# Altium schematic sheet misc.SchDoc
size A4
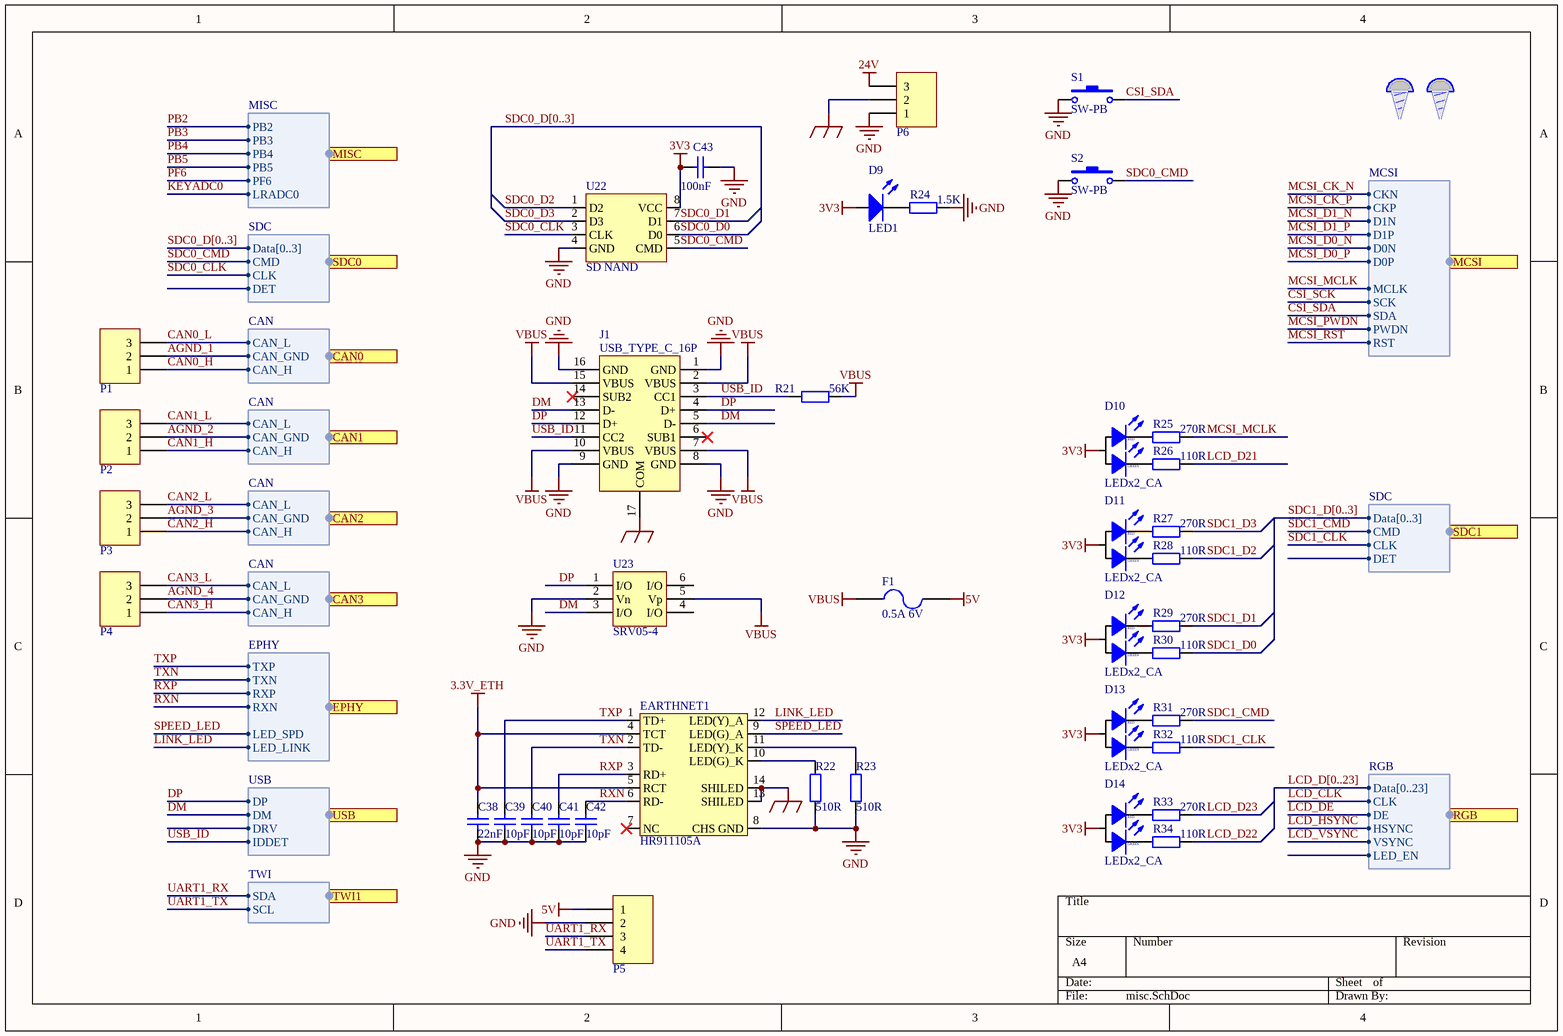
[diagram p0: misc.SchDoc]

## Parts
C38  22nF  [CAPC1608L]
C39  10pF  [CAPC1608L]
C40  10pF  [CAPC1608L]
C41  10pF  [CAPC1608L]
C42  10pF  [CAPC1608L]
C43  100nF  [CAPC1608L]
D9  LED1  [LED_3]
D10  LEDx2_CA  [LED_3x2]
D11  LEDx2_CA  [LED_3x2]
D12  LEDx2_CA  [LED_3x2]
D13  LEDx2_CA  [LED_3x2]
D14  LEDx2_CA  [LED_3x2]
EARTHNET1  HR911105A  [HR911105A]
F1  0.5A 6V  [FUSE2012L]
J1  USB_TYPE_C_16P  [USB_TYPEC_16P]
M1  M  [M3]  (value not drawn)
M2  M  [M3]  (value not drawn)
P1  Header 3  [KF2EDGR-5.08-3P_S]  (value not drawn)
P2  Header 3  [KF2EDGR-5.08-3P_S]  (value not drawn)
P3  Header 3  [KF2EDGR-5.08-3P_S]  (value not drawn)
P4  Header 3  [KF2EDGR-5.08-3P_S]  (value not drawn)
P5  Header 4  [HDR1X4]  (value not drawn)
P6  Header 3  [KF2EDGR-5.08-3P_S]  (value not drawn)
R21  56K  [RESC1005L]
R22  510R  [RESC1608L]
R23  510R  [RESC1608L]
R24  1.5K  [RESC1608L]
R25  270R  [RESC1608L]
R26  110R  [RESC1608L]
R27  270R  [RESC1608L]
R28  110R  [RESC1608L]
R29  270R  [RESC1608L]
R30  110R  [RESC1608L]
R31  270R  [RESC1608L]
R32  110R  [RESC1608L]
R33  270R  [RESC1608L]
R34  110R  [RESC1608L]
S1  SW-PB  [SW_4.5x3.8]
S2  SW-PB  [SW-3x6]
U22  SD NAND  [QFN8_L]
U23  SRV05-4  [SOT23-6_L]

## Ports
CAN0 (harness CAN), CAN1 (harness CAN), CAN2 (harness CAN), CAN3 (harness CAN), EPHY (harness EPHY), MCSI (harness MCSI), MISC (harness MISC), RGB (harness RGB), SDC0 (harness SDC), SDC1 (harness SDC), TWI1 (harness TWI), USB (harness USB)

## Harnesses
SDC: Data[0..3], CMD, CLK, DET
CAN: CAN_L, CAN_GND, CAN_H
EPHY: TXP, TXN, RXP, RXN, LED_SPD, LED_LINK
USB: DP, DM, DRV, IDDET
MISC: PB2, PB3, PB4, PB5, LRADC0, PF6
MCSI: CKN, CKP, D1N, D1P, D0N, D0P, MCLK, SCK, SDA, PWDN, RST
RGB: Data[0..23], CLK, DE, HSYNC, VSYNC, LED_EN
TWI: SDA, SCL

## Nets
3.3V_ETH: C38.2 EARTHNET1.4(TCT) EARTHNET1.5(RCT)
3V3: C43.1 D9.1(A) D10.2(A) D11.2(A) D12.2(A) D13.2(A) D14.2(A) U22.8(VCC)
5V: F1.2 P5.1
24V: P6.3
EARTH: EARTHNET1.13(SHILED) EARTHNET1.14(SHILED) J1.17(COM) P6.2
GND: C38.1 C39.1 C40.1 C41.1 C42.1 C43.2 EARTHNET1.8(CHS_GND) J1.1(GND) J1.8(GND) J1.9(GND) J1.16(GND) P5.2 P6.1 R22.1 R23.1 R24.2 S1.1 S2.1 U22.4(GND) U23.2(Vn)
VBUS: F1.1 J1.2(VBUS) J1.7(VBUS) J1.10(VBUS) J1.15(VBUS) R21.2 U23.5(Vp)
AGND_1: P1.2 ; port CAN0.CAN_GND
AGND_2: P2.2 ; port CAN1.CAN_GND
AGND_3: P3.2 ; port CAN2.CAN_GND
AGND_4: P4.2 ; port CAN3.CAN_GND
CAN0_H: P1.1 ; port CAN0.CAN_H
CAN0_L: P1.3 ; port CAN0.CAN_L
CAN1_H: P2.1 ; port CAN1.CAN_H
CAN1_L: P2.3 ; port CAN1.CAN_L
CAN2_H: P3.1 ; port CAN2.CAN_H
CAN2_L: P3.3 ; port CAN2.CAN_L
CAN3_H: P4.1 ; port CAN3.CAN_H
CAN3_L: P4.3 ; port CAN3.CAN_L
CSI_SCK: port MCSI.SCK
CSI_SDA: S1.2 ; port MCSI.SDA
DM: J1.5(D-) J1.13(D-) U23.3(I/O) ; port USB.DM
DP: J1.4(D+) J1.12(D+) U23.1(I/O) ; port USB.DP
KEYADC0: port MISC.LRADC0
LCD_CLK: port RGB.CLK
LCD_D21: R26.2
LCD_D22: R34.2
LCD_D23: R33.2
LCD_DE: port RGB.DE
LCD_HSYNC: port RGB.HSYNC
LCD_VSYNC: port RGB.VSYNC
LINK_LED: EARTHNET1.12(LED(Y)_A) ; port EPHY.LED_LINK
MCSI_CK_N: port MCSI.CKN
MCSI_CK_P: port MCSI.CKP
MCSI_D0_N: port MCSI.D0N
MCSI_D0_P: port MCSI.D0P
MCSI_D1_N: port MCSI.D1N
MCSI_D1_P: port MCSI.D1P
MCSI_MCLK: R25.2 ; port MCSI.MCLK
MCSI_PWDN: port MCSI.PWDN
MCSI_RST: port MCSI.RST
PB2: port MISC.PB2
PB3: port MISC.PB3
PB4: port MISC.PB4
PB5: port MISC.PB5
PF6: port MISC.PF6
RXN: C42.2 EARTHNET1.6(RD-) ; port EPHY.RXN
RXP: C41.2 EARTHNET1.3(RD+) ; port EPHY.RXP
SDC0_CLK: U22.3(CLK) ; port SDC0.CLK
SDC0_CMD: S2.2 U22.5(CMD) ; port SDC0.CMD
SDC0_D0: U22.6(D0)
SDC0_D1: U22.7(D1)
SDC0_D2: U22.1(D2)
SDC0_D3: U22.2(D3)
SDC1_CLK: R32.2 ; port SDC1.CLK
SDC1_CMD: R31.2 ; port SDC1.CMD
SDC1_D0: R30.2
SDC1_D1: R29.2
SDC1_D2: R28.2
SDC1_D3: R27.2
SPEED_LED: EARTHNET1.9(LED(G)_A) ; port EPHY.LED_SPD
TXN: C40.2 EARTHNET1.2(TD-) ; port EPHY.TXN
TXP: C39.2 EARTHNET1.1(TD+) ; port EPHY.TXP
UART1_RX: P5.3 ; port TWI1.SDA
UART1_TX: P5.4 ; port TWI1.SCL
USB_ID: J1.3(CC1) J1.11(CC2) R21.1 ; port USB.IDDET
NetD9_2: D9.2(K) R24.1
NetD10_1: D10.1(K) R26.1
NetD10_3: D10.3(K) R25.1
NetD11_1: D11.1(K) R28.1
NetD11_3: D11.3(K) R27.1
NetD12_1: D12.1(K) R30.1
NetD12_3: D12.3(K) R29.1
NetD13_1: D13.1(K) R32.1
NetD13_3: D13.3(K) R31.1
NetD14_1: D14.1(K) R34.1
NetD14_3: D14.3(K) R33.1
NetEARTHNET1_10: EARTHNET1.10(LED(G)_K) R22.2
NetEARTHNET1_11: EARTHNET1.11(LED(Y)_K) R23.2

Not connected (* = marked no-connect by the designer): EARTHNET1 7(NC)*; J1 6(SUB1)* 14(SUB2)*; U23 4(I/O) 6(I/O)

## Buses and harness runs
bus LCD_D[0..23]
bus SDC0_D[0..3]
bus SDC1_D[0..3]

## Notes on the sheet
- (in symbol LEDx2_CA) RED; GREEN

## Library data of the parts
C38-C43 = Cap1: Capacitor; Published: 8-Jun-2000; LatestRevisionDate: 17-Jul-2002; LatestRevisionNote: Re-released for DXP Platform.; PackageReference: RAD-0.3; Publisher: Altium Limited
  C38: Value: 22nF
  C39-C42: Value: 10pF
  C43: Value: 100nF
D9 = LED1: Typical RED GaAs LED; Published: 8-Jun-2000; LatestRevisionDate: 08-Jul-2005; LatestRevisionNote: Mech Layer 1 removed.; PackageReference: LED-1; Publisher: Altium Limited; PackageDescription: LED; 2 Leads
D10-D14 = LEDx2_CA: 共阳红绿双色二极管; Published: 8-Jun-2000; LatestRevisionDate: 08-Jul-2005; LatestRevisionNote: Mech Layer 1 removed.; PackageReference: LED-1; Publisher: Altium Limited; PackageDescription: LED; 2 Leads
F1 = Fuse 2: Fuse; Published: 8-Jun-2000; LatestRevisionDate: 17-Jul-2002; LatestRevisionNote: Re-released for DXP Platform.; PackageReference: PIN-W2/E2.8; Publisher: Altium Limited; PackageDescription: Thru-Hole; 2 Leads
P1-P4 P6 = Header 3: Header, 3-Pin; LatestRevisionDate: 17-Jul-2002; LatestRevisionNote: Re-released for DXP Platform.; Publisher: Altium Limited
P5 = Header 4: Header, 4-Pin; LatestRevisionDate: 17-Jul-2002; LatestRevisionNote: Re-released for DXP Platform.; Publisher: Altium Limited
R21-R34 = Res1: Resistor; Published: 8-Jun-2000; LatestRevisionDate: 17-Jul-2002; LatestRevisionNote: Re-released for DXP Platform.; PackageReference: AXIAL-0.4; Publisher: Altium Limited
  R21: Value: 56K
  R22 R23: Value: 510R
  R24: Value: 1.5K
  R25 R27 R29 R31 R33: Value: 270R
  R26 R28 R30 R32 R34: Value: 110R
S1 S2 = SW-PB: Switch; Published: 24-Mar-1999; LatestRevisionDate: 17-Jul-2002; LatestRevisionNote: Re-released for DXP Platform.; PackageReference: SPST-2; Publisher: Altium Limited; PackageDescription: Switch; 2 Leads
U22 = SD NAND: 贴片式SD卡
U23 = NUP4201